# EAGLE design Continuity Tester (EAGLE 9.1.0)
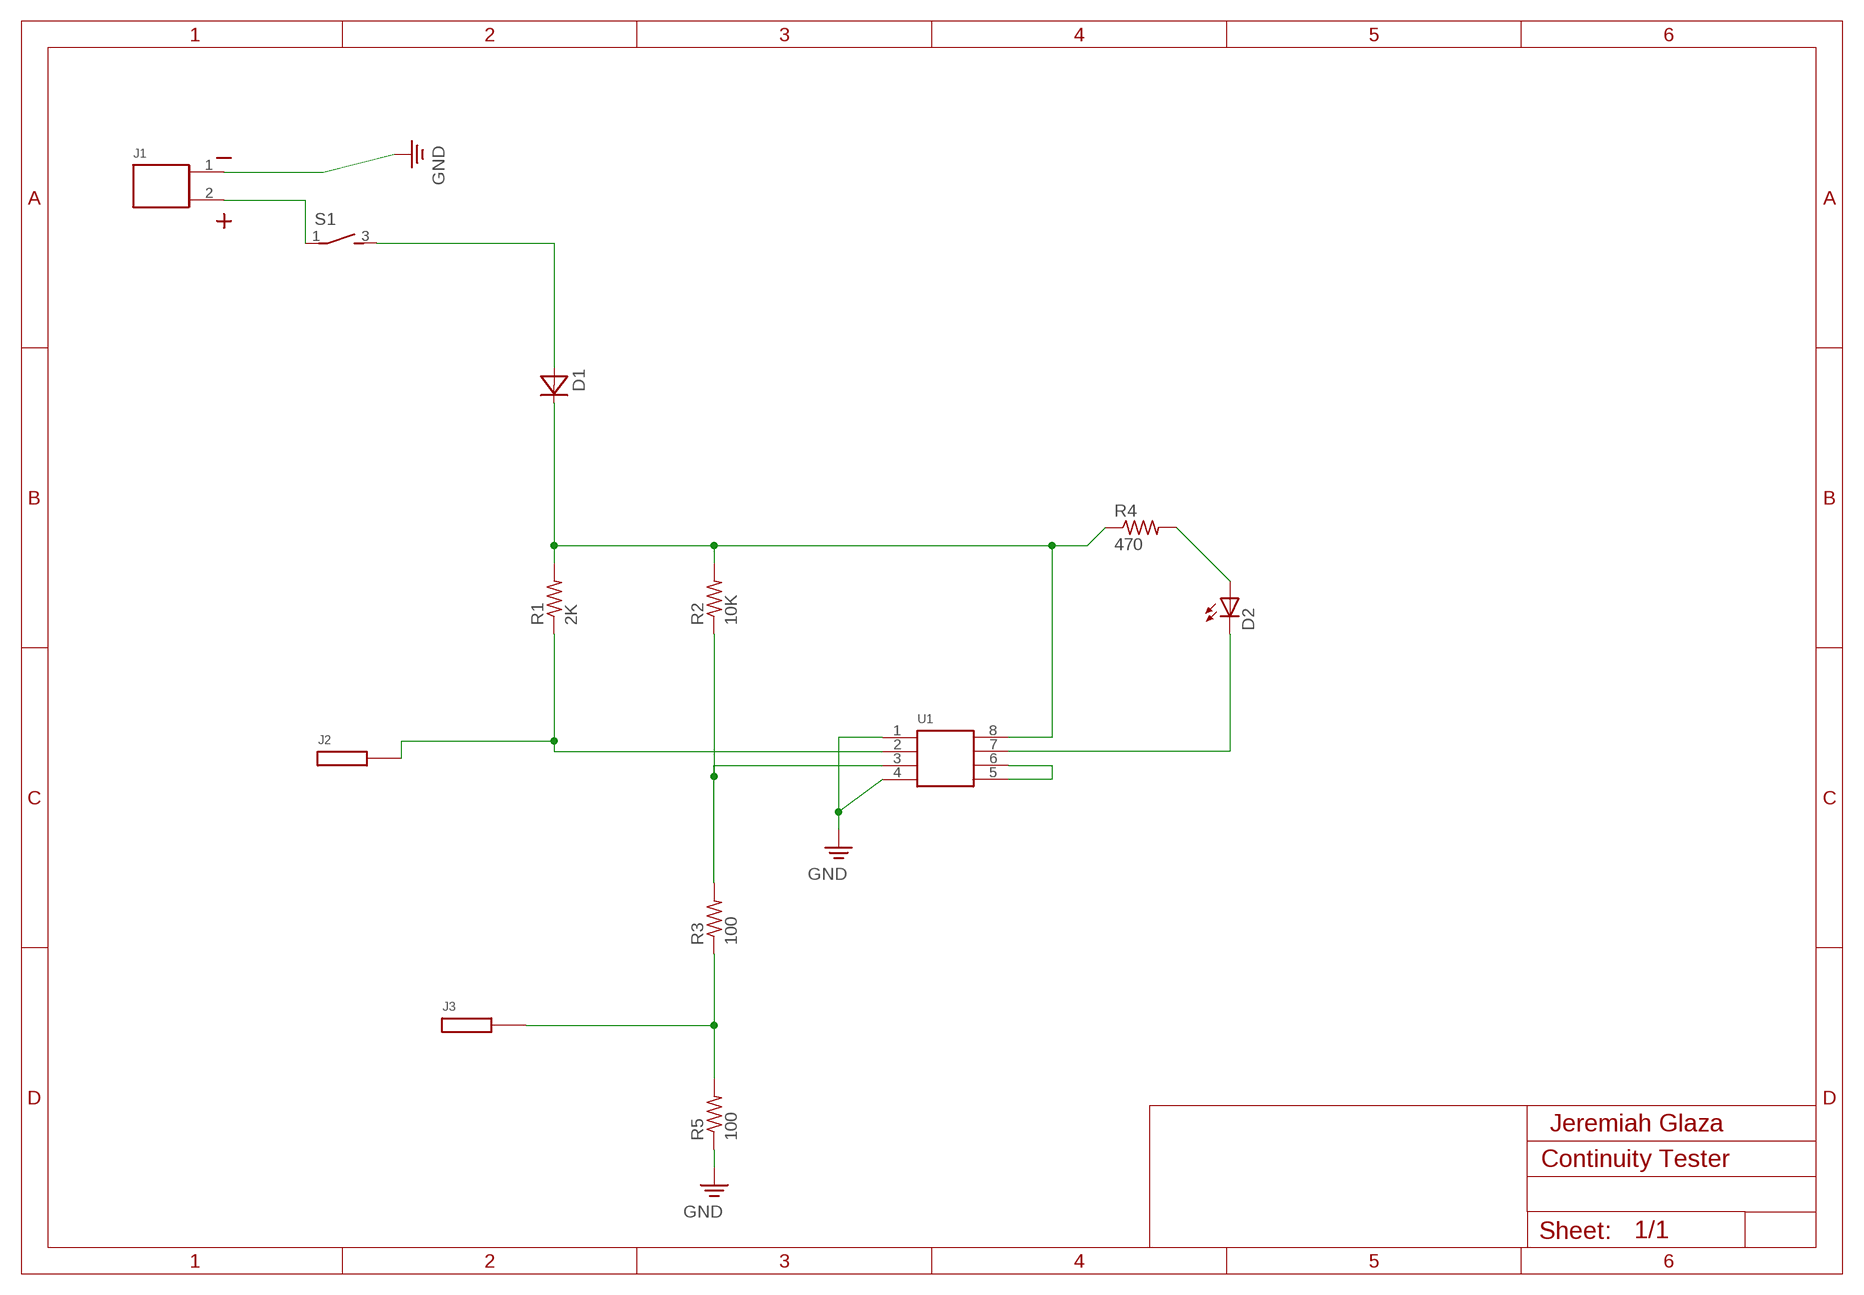
[diagram p0: schematic, sheet 1]

## Parts
D1  DIODE  [DIODE-FOOT]
D2  LED  [LED-FOOT]
J1  POWER  [POWER-FOOT]
J2  ALLIGATORCLIP  [ALLIGATORCLIP-FOOT]
J3  ALLIGATORCLIP  [ALLIGATORCLIP-FOOT]
R1  2K  RES  [RES-FOOT]
R2  10K  RES  [RES-FOOT]
R3  100  RES  [RES-FOOT]
R4  470  RES  [RES-FOOT]
R5  100  RES  [RES-FOOT]
S1  SWITCH  [SWITCH-FOOT]
U1  LM311M  [LM311M-FOOT]

## Nets
N$1: J1.2 S1.1
N$2: D1.A S1.3
N$3: U1.5 U1.6
N$4: D1.C R1.2 R2.2 R4.1 U1.8
N$5: D2.A R4.2
N$6: D2.C U1.7
N$8: J2.1 R1.1 U1.2
N$9: R2.1 R3.2 U1.3
N$10: J3.1 R3.1 R5.2
PE: J1.1 R5.1 U1.1 U1.4 ; supply symbol labelled GND

## Notes on the sheet
- Jeremiah Glaza

## Library data of the parts
D1 = Glaza_MyLibrary:DIODE
D2 = Glaza_MyLibrary:LED
J1 = Glaza_MyLibrary:POWER
J2 J3 = Glaza_MyLibrary:ALLIGATORCLIP
R1-R5 = Glaza_MyLibrary:RES
S1 = Glaza_MyLibrary:SWITCH
U1 = Glaza_MyLibrary:LM311M

## Board
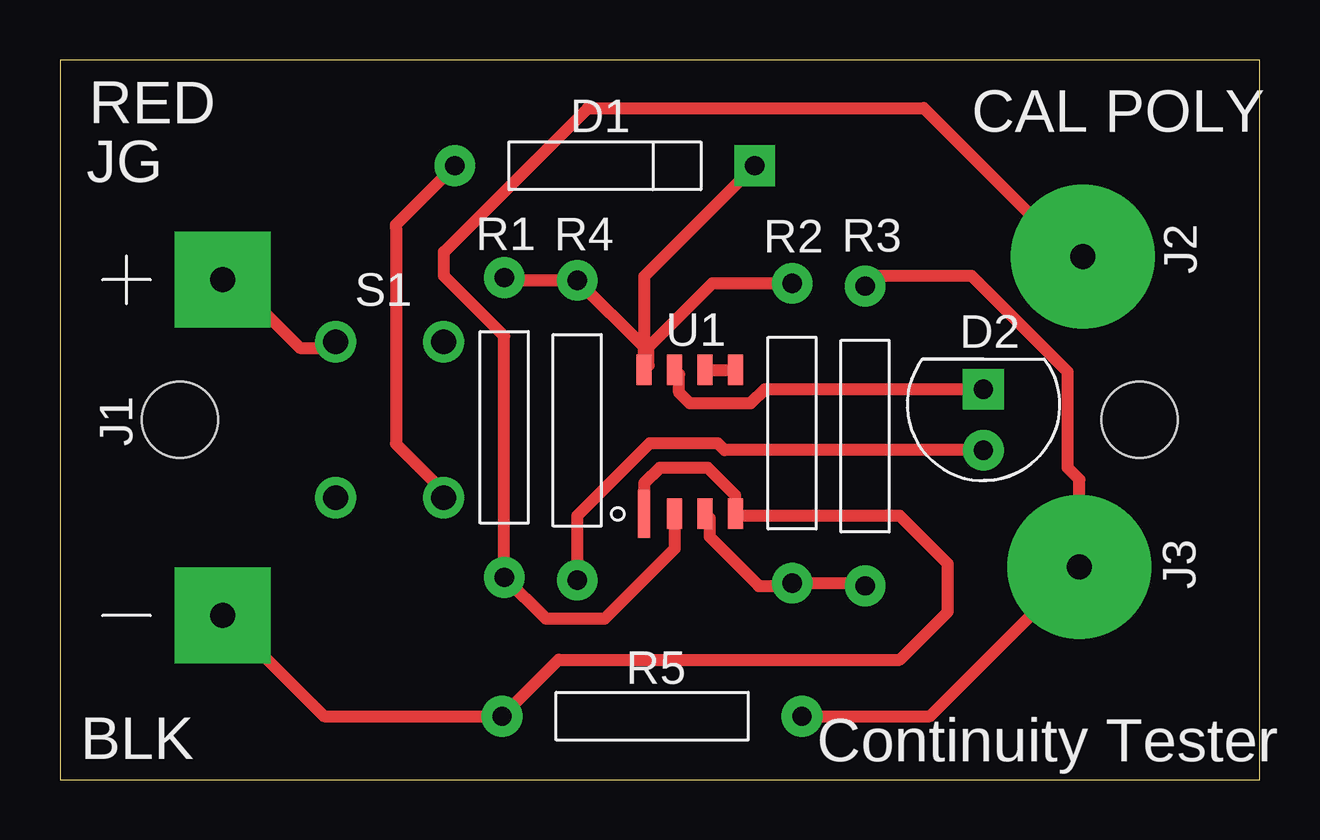
[diagram p1: board, top side]

Size 50 x 30 mm. Coordinates in mm from the lower left corner, seen from the top.
Outline: 0,0 50,0 50,30 0,30 0,0
Copper layers (1*16): Top 0.035mm / dielectric 1.5mm / Bottom 0.035mm
Design rules "default *": minimum track width 6mil, minimum drill 0.35mm, track to track 20mil, track to pad 20mil, pad to pad 20mil, via to via 20mil, smd to smd 20mil, copper to edge 40mil, drill to drill 6mil, minimum pad ring 10mil, minimum via ring 8mil, stop-mask expansion 4mil, vias tented up to drill 0mil, thermal gap 10mil
Holes 3.17 mm at 5,15 45,15

### Footprints (pad centres in the part's own frame; a part is rotated, then mirrored left to right if it is on the bottom)
DIODE-FOOT = drill 0.8 pad 1.7: A -6.25,0 | drill 0.8 pad 1.7 square: C 6.25,0
LED-FOOT = drill 0.8 pad 1.7: A 0,-1.27 | drill 0.8 pad 1.7 square: C 0,1.27
POWER-FOOT = drill 1.041 pad 4 square: 1 0,7; 2 0,-7
ALLIGATORCLIP-FOOT = drill 1.041 pad 6: 1 0,0
RES-FOOT = drill 0.8 pad 1.7: 1 -6.25,0; 2 6.25,0
SWITCH-FOOT = drill 1.041 pad 1.727: 1 -2.25,3.25; 2 -2.25,-3.25; 3 2.25,-3.25; 4 2.25,3.25
LM311M-FOOT = smd 0.5 x 2: 1 -1.905,-3 | smd 0.635 x 1.27: 2 -0.635,-3; 3 0.635,-3; 4 1.905,-3; 5 1.905,3; 6 0.635,3; 7 -0.635,3; 8 -1.905,3

### Placement (x,y rotation side)
D1  22.71,25.59 0 top
D2  38.49,15 0 top
J1  6.78,13.84 180 top
J2  42.63,21.81 0 top
J3  42.49,8.86 0 top
R1  18.52,14.68 90 top
R2  30.52,14.44 90 top
R3  33.56,14.32 270 top
R4  21.56,14.56 270 top
R5  24.68,2.64 0 top
S1  13.74,15 0 top
U1  26.25,14.08 0 top

### Tracks (layer width: path | path; a pad name or v marks a point on that pad's centre or on a via)
N$1
  Top 0.508: J1.2 7.16,20.84 10,18 11.24,18 S1.1
N$2
  Top 0.152: 14,23.13 14,23
  Top 0.508: D1.A 14,23.13 | 14,23 14,14 15.99,12.01 S1.3
N$3
  Top 0.508: U1.6 U1.5
N$4
  Top 0.508: R2.2 27.2,20.69 24.54,18.03 24.54,17.27 U1.8 24.34,18.02 | 24.34,18.02 R4.1 18.64,20.81 R1.2 | D1.C 24.34,20.98 24.34,18.02
N$5
  Top 0.508: D2.A 27.71,13.73 27.42,14.02 24.58,14.02 21.56,11 R4.2
N$6
  Top 0.508: U1.7 25.8,16.89 25.8,16.13 26.25,15.68 28.79,15.68 29.38,16.27 D2.C
N$8
  Top 0.508: U1.2 25.61,9.62 22.7,6.7 20.25,6.7 R1.1 18.52,18.48 16,21 16,22 22,28 36,28 42.19,21.81 J2.1
N$9
  Top 0.508: U1.3 27.08,10.89 27.08,10.13 29.14,8.07 30.4,8.07 R2.1 33.44,8.19 R3.2
N$10
  Top 0.508: R5.2 36.27,2.64 J3.1 42.49,12.51 42,13 42,17 38,21 33.99,21 R3.1
PE
  Top 0.508: U1.1 24.34,12.35 25,13 27,13 28.16,11.85 U1.4 28.23,11 35,11 37,9 37,7 35,5 20.79,5 R5.1 11,2.64 7.8,5.84 7.78,5.84 J1.1

### Text on the board
tNames: RED | CAL POLY | JG | BLK | Continuity Tester